# Altium project E77whistle.PrjPcb
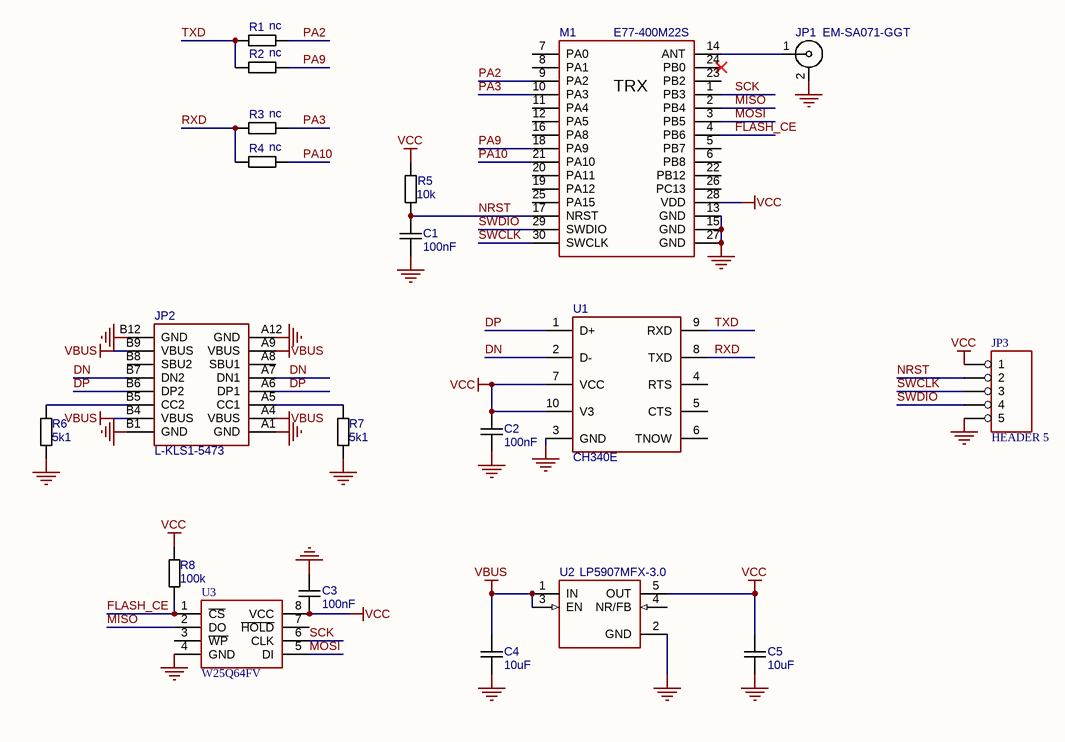
[diagram p0: E77whistle.SchDoc]
1 sheet, 20 parts. Net scope: global (net labels, ports and power ports of the same name join across sheets).
Board file: E77whistle.PcbDoc

## Sheet E77whistle.SchDoc
size 431 x 279 mm; SheetNumber: 1; SheetTotal: 1

### Parts
C1  100nF  [C-0603]
C2  100nF  [C-0603]
C3  100nF  [C-0603]
C4  10uF  [C-0805]
C5  10uF  [C-0805]
JP1  EM-SA071-GGT  [SMA_F_EDGE]
JP2  L-KLS1-5473  [L-KLS1-5473]
JP3  HEADER 5  [PLS1-5_SMD]
M1  E77-400M22S  [E77XX-M22]
R1  nc  [R-0603]
R2  nc  [R-0603]
R3  nc  [R-0603]
R4  nc  [R-0603]
R5  10k  [R-0603]
R6  5k1  [R-0603]
R7  5k1  [R-0603]
R8  100k  [R-0603]
U1  CH340E  [MSOP-10]
U2  LP5907MFX-3.0  [SOT-23-5]
U3  W25Q64FV  [SO-8]

### Nets
GND: C1.1 C2.1 C3.1 C4.2 C5.2 JP1.2 JP2.A1(GND) JP2.A12(GND) JP2.B1(GND) JP2.B12(GND) JP3.5 M1.13(GND) M1.15(GND) M1.27(GND) R6.2 R7.2 U1.3(GND) U2.2(GND) U3.4(GND)
VBUS: C4.1 JP2.A4(VBUS) JP2.A9(VBUS) JP2.B4(VBUS) JP2.B9(VBUS) U2.1(IN) U2.3(EN)
VCC: C2.2 C3.2 C5.1 JP3.1 M1.28(VDD) R5.2 R8.2 U1.7(VCC) U1.10(V3) U2.5(OUT) U3.8(VCC)
DN: JP2.A7(DN1) JP2.B7(DN2) U1.2(D-)
DP: JP2.A6(DP1) JP2.B6(DP2) U1.1(D+)
FLASH_CE: M1.4(PB6) R8.1 U3.1(~{CS})
MISO: M1.2(PB4) U3.2(DO)
MOSI: M1.3(PB5) U3.5(DI)
NRST: C1.2 JP3.2 M1.17(NRST) R5.1
PA2: M1.9(PA2) R1.1
PA3: M1.10(PA3) R3.1
PA9: M1.18(PA9) R2.1
PA10: M1.21(PA10) R4.1
RXD: R3.2 R4.2 U1.8(TXD)
SCK: M1.1(PB3) U3.6(CLK)
SWCLK: JP3.3 M1.30(SWCLK)
SWDIO: JP3.4 M1.29(SWDIO)
TXD: R1.2 R2.2 U1.9(RXD)
NetJP1_1: JP1.1 M1.14(ANT)
NetJP2_A5: JP2.A5(CC1) R7.1
NetJP2_B5: JP2.B5(CC2) R6.1

Not connected (* = marked no-connect by the designer): JP2 17(VSS) A8(SBU1) B8(SBU2); M1 5(PB7) 6(PB8) 7(PA0) 8(PA1) 11(PA4) 12(PA5) 16(PA8) 19(PA12) 20(PA11) 22(PB12) 23(PB2) 24(PB0)* 25(PA15) 26(PC13); U1 4(RTS) 5(CTS) 6(TNOW); U2 4(NR/FB); U3 3(~{WP}) 7(~{HOLD})

### Notes on the sheet
- DWG. NO.
- REV.
- SHT.
- THIS DOCUMENT AND THE DATA DISCLOSED HEREIN OR HEREWITH IS THE PROPERTY OF ALTIUM LIMITED AND MAY BE FREELY DISTRIBUTED IN WHOLE. NO RIGHTS ARE RESERVED OR EXPRESS OR IMPLIED WARANTEE GIVEN.
- REVISION
- DESCRIPTION
- DATE
- APPROVED
- ENG:
- APPROVALS
- PROJECT
- DSN:
- CHK:
- REFERENCE DOCUMENTS
- PROJECT REVISION:
- TITLE
- DOCUMENT REVISION:
- DESIGN ITEM:
- BOM:
- FAB DWG:
- PCB DWG:
- ASSY DWG:
- SCALE:
- SIZE
- B
- CAGE CODE
- FILE NAME
- DWG NO.
- SHEET
- OF
- REV
- (in symbol E77-400M22S) TRX

### Library data of the parts
C1-C5 = CAPN: Voltage: 50V; Точність/група: NP0; Вид: Конденсатор
JP1 = SMA: SMA Female R/A PCB Mount; Вид: Роз'єм
JP2 = L-KLS1-5473: Mounting  Method: SMD; Value: *
JP3 = HEADER 5: Вид: Роз'єм; *: *
R1-R8 = RES: Точність/група: 5%; Вид: Резистор
U1 = CH340E: Value: {Value}; Mounting  Method: SMD
U2 = LP5907: 250mA Low-Dropout Regulator; Вид: Мікросхема
U3 = W25Q64FV: Вид: Мікросхема